# EAGLE schematic TA323v1 (EAGLE 7.2.0)
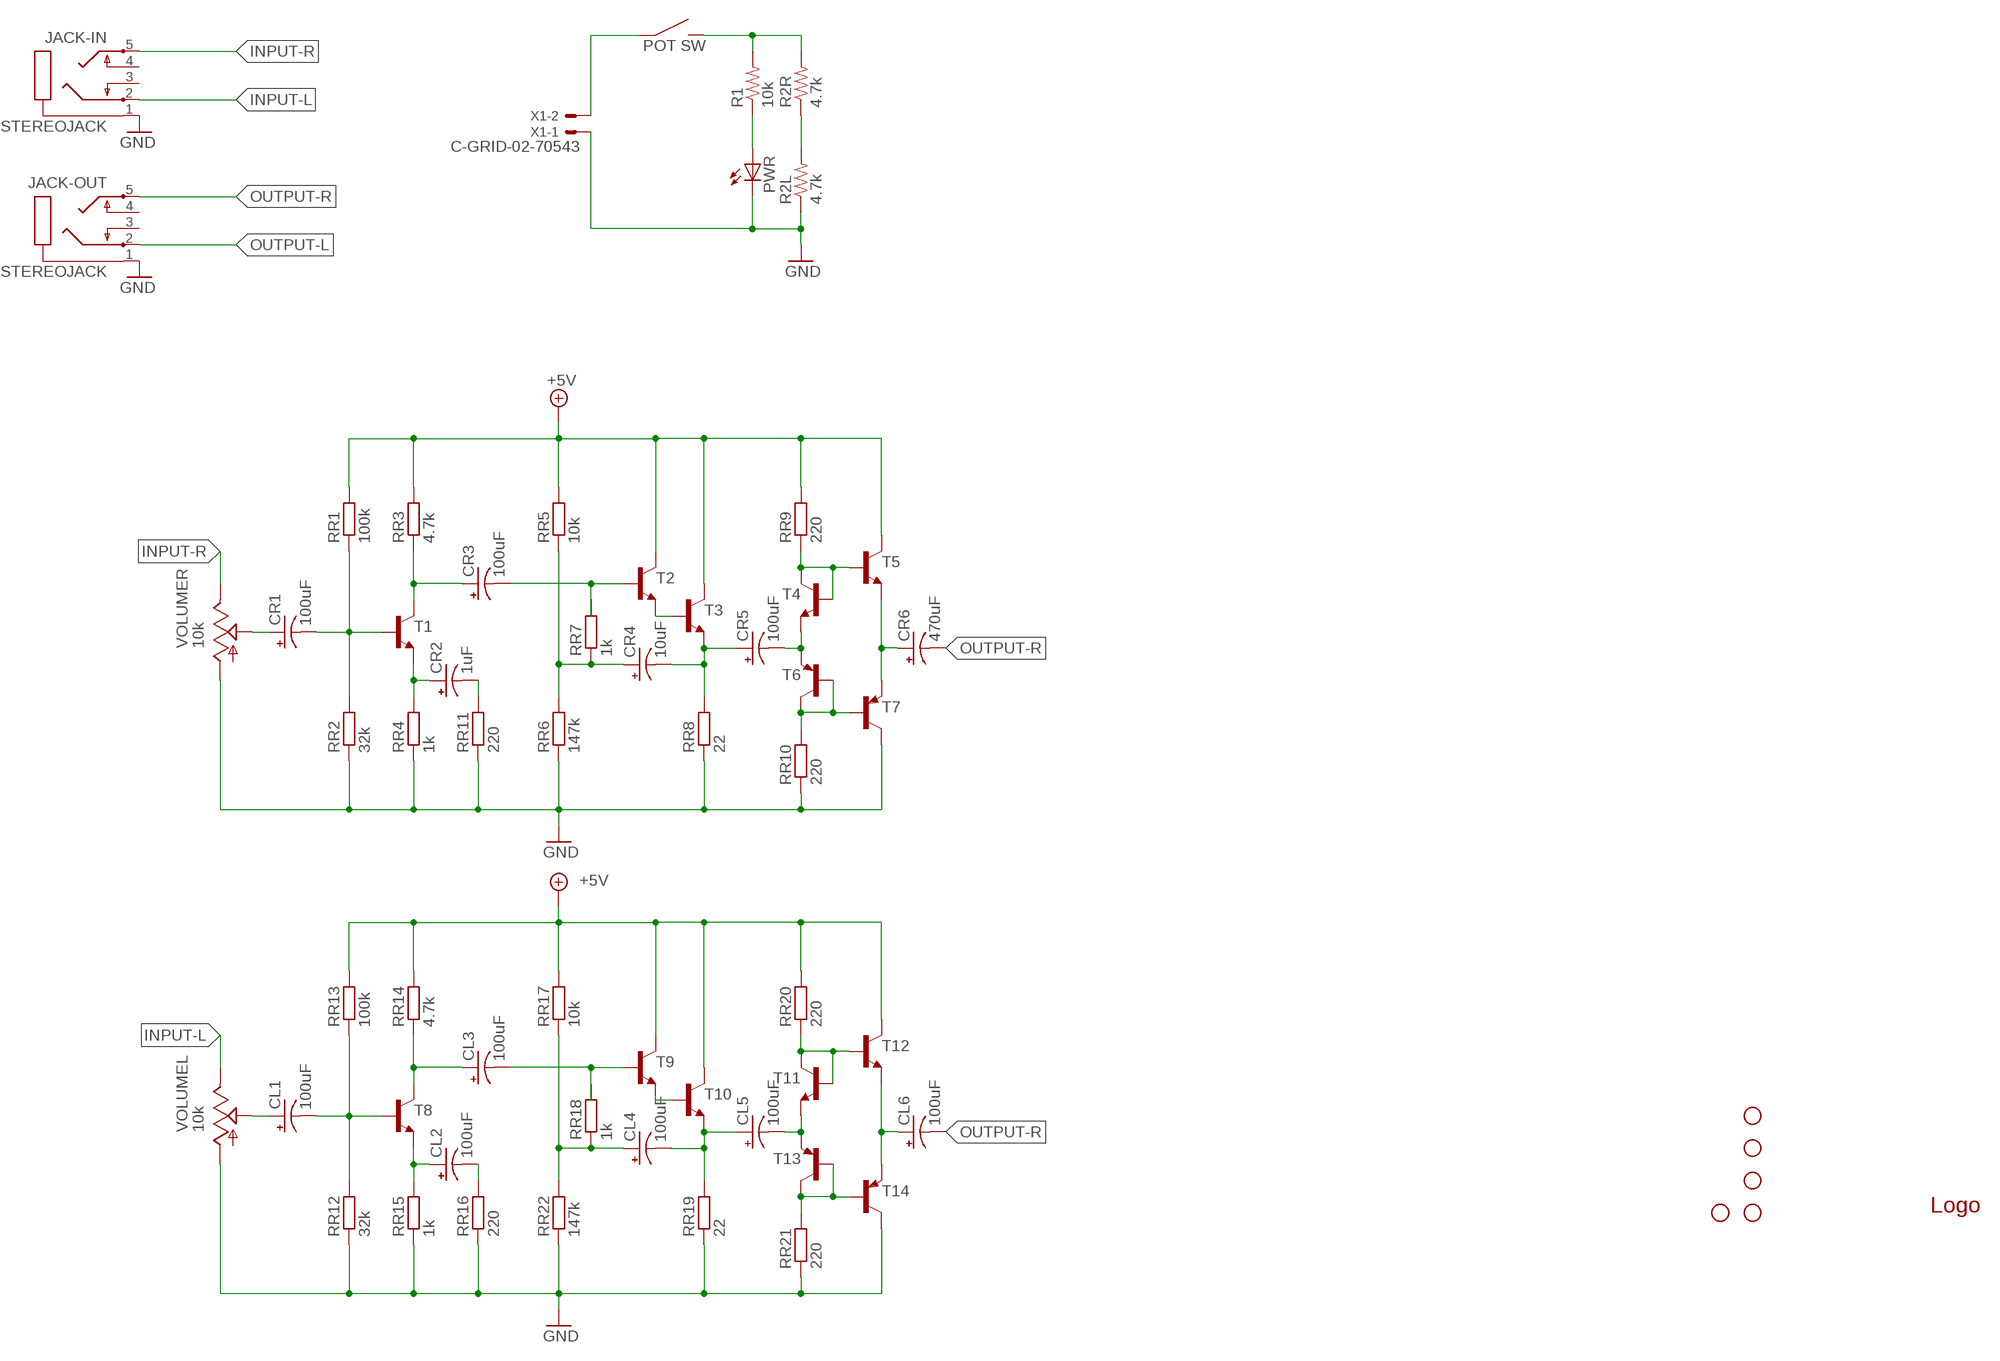
[diagram p0: schematic, sheet 1]

## Parts
CL1  100uF  CPOL-USE5-10.5  [E5-10,5]
CL2  100uF  CPOL-USE5-10.5  [E5-10,5]
CL3  100uF  CPOL-USE5-10.5  [E5-10,5]
CL4  100uF  CPOL-USE5-10.5  [E5-10,5]
CL5  100uF  CPOL-USE5-10.5  [E5-10,5]
CL6  100uF  CPOL-USE5-10.5  [E5-10,5]
CR1  100uF  CPOL-USE5-10.5  [E5-10,5]
CR2  1uF  CPOL-USE5-10.5  [E5-10,5]
CR3  100uF  CPOL-USE5-10.5  [E5-10,5]
CR4  10uF  CPOL-USE5-10.5  [E5-10,5]
CR5  100uF  CPOL-USE5-10.5  [E5-10,5]
CR6  470uF  CPOL-USE5-10.5  [E5-10,5]
JACK-IN  STEREOJACK  [STX3100]
JACK-OUT  STEREOJACK  [STX3100]
JP1  STAND-OFF  [STAND-OFF]
JP2  STAND-OFF  [STAND-OFF]
JP3  STAND-OFF  [STAND-OFF]
JP4  STAND-OFF  [STAND-OFF]
JP5  STAND-OFF  [STAND-OFF]
PWR  LED-3MM-MINUS  [LED3MM-MINUS]
R1  10k  RESISTOR-PTH-1/6W-OUTLINE  [1/6W-RES-OUTLINE]
R2L  4.7k  RESISTOR-PTH-1/6W-OUTLINE  [1/6W-RES-OUTLINE]
R2R  4.7k  RESISTOR-PTH-1/6W-OUTLINE  [1/6W-RES-OUTLINE]
RR1  100k  R-EU_0204/7  [0204/7]
RR2  32k  R-EU_0204/7  [0204/7]
RR3  4.7k  R-EU_0204/7  [0204/7]
RR4  1k  R-EU_0204/7  [0204/7]
RR5  10k  R-EU_0204/7  [0204/7]
RR6  147k  R-EU_0204/7  [0204/7]
RR7  1k  R-EU_0204/7  [0204/7]
RR8  22  R-EU_0204/7  [0204/7]
RR9  220  R-EU_0204/7  [0204/7]
RR10  220  R-EU_0204/7  [0204/7]
RR11  220  R-EU_0204/7  [0204/7]
RR12  32k  R-EU_0204/7  [0204/7]
RR13  100k  R-EU_0204/7  [0204/7]
RR14  4.7k  R-EU_0204/7  [0204/7]
RR15  1k  R-EU_0204/7  [0204/7]
RR16  220  R-EU_0204/7  [0204/7]
RR17  10k  R-EU_0204/7  [0204/7]
RR18  1k  R-EU_0204/7  [0204/7]
RR19  22  R-EU_0204/7  [0204/7]
RR20  220  R-EU_0204/7  [0204/7]
RR21  220  R-EU_0204/7  [0204/7]
RR22  147k  R-EU_0204/7  [0204/7]
T1  2N4401-NPN-TO92-EBC  [TO92-EBC]
T2  2N4401-NPN-TO92-EBC  [TO92-EBC]
T3  2N4401-NPN-TO92-EBC  [TO92-EBC]
T4  2N4401-NPN-TO92-EBC  [TO92-EBC]
T5  2N4401-NPN-TO92-EBC  [TO92-EBC]
T6  2N4403-PNP-TO92-EBC  [TO92-EBC]
T7  2N4403-PNP-TO92-EBC  [TO92-EBC]
T8  2N4401-NPN-TO92-EBC  [TO92-EBC]
T9  2N4401-NPN-TO92-EBC  [TO92-EBC]
T10  2N4401-NPN-TO92-EBC  [TO92-EBC]
T11  2N4401-NPN-TO92-EBC  [TO92-EBC]
T12  2N4401-NPN-TO92-EBC  [TO92-EBC]
T13  2N4403-PNP-TO92-EBC  [TO92-EBC]
T14  2N4403-PNP-TO92-EBC  [TO92-EBC]
U$1  OSHW-LOGO-OUTLINE  [OSHW-LOGO-OUTLINE]
VOLUME  10k  ALPS_RK0971221Z0N  [ALPS_RK0971221Z0X]
X1  C-GRID-02-70543  [70543-02]

## Nets
+5V: RR1.2 RR3.2 RR5.2 RR9.2 RR13.2 RR14.2 RR17.2 RR20.2 T2.C T3.C T5.C T9.C T10.C T12.C
+9V: R1.2 R2R.2 VOLUME.S2
GND: JACK-IN.1 JACK-OUT.1 PWR.K(C) R2L.1 RR2.1 RR4.1 RR6.1 RR8.1 RR10.1 RR11.1 RR12.1 RR15.1 RR16.1 RR19.1 RR21.1 RR22.1 T7.C T14.C VOLUME.G1 VOLUME.G2 X1.1
INPUT-L: JACK-IN.2 VOLUME.I1
INPUT-R: JACK-IN.5 VOLUME.I2
N$1: PWR.A R1.1
N$2: VOLUME.S1 X1.2
N$3: T2.E T3.B
N$4: CR3.+ RR3.1 T1.C
N$5: RR20.1 T11.B T11.C T12.B
N$6: CL5.- T11.E T13.E
N$7: RR21.2 T13.B T13.C T14.B
N$8: CL6.+ T12.E T14.E
N$9: CL4.- CL5.+ RR19.2 T10.E
N$10: CL4.+ RR17.1 RR18.1 RR22.2
N$11: CL3.- T9.B
N$12: CL2.- RR16.2
N$13: CL2.+ RR15.2 T8.E
N$14: CL1.+ VOLUME.O1
N$15: T9.E T10.B
N$16: CL3.+ RR14.1 T8.C
N$18: R2L.2 R2R.1
N$22: RR9.1 T4.B T4.C T5.B
N$23: CR5.- T4.E T6.E
N$24: RR10.2 T6.B T6.C T7.B
N$25: CR6.+ T5.E T7.E
N$26: CR4.- CR5.+ RR8.2 T3.E
N$27: CR4.+ RR5.1 RR6.2 RR7.1
N$28: CR3.- T2.B
N$30: CR2.- RR11.2
N$31: CR2.+ RR4.2 T1.E
N$32: CR1.+ VOLUME.O2
OUTPUT-L: JACK-OUT.2
OUTPUT-R: JACK-OUT.5
R+: CR1.- RR1.1 RR2.2 T1.B
R+1: CL1.- RR12.2 RR13.1 T8.B
Unconnected: CL6.- CR6.- JACK-IN.3 JACK-IN.4 JACK-OUT.3 JACK-OUT.4 RR7.2 RR18.2

## Library data of the parts
CL1-CL6 CR1-CR6 = rcl:CPOL-US: POLARIZED CAPACITOR, American symbol
JACK-IN JACK-OUT = akafugu:STEREOJACK: MIC/HEADPHONE JACK Stereo jack with two switches. Kycon STX3100, CUI SJ1-3555NG and/or 4UCon 05544
JP1-JP5 = SparkFun:STAND-OFF: Stand Off This is the mechanical footprint for a #4 phillips button head screw. Use the keepout ring to avoid running the screw head into surrounding components. SKU : PRT-00447
PWR = akafugu:LED: LEDs Standard schematic elements and footprints for 5mm, 3mm, 1206, and 0603 sized LEDs. 5mm - Spark Fun Electronics SKU : COM-00529 (and others)
R1 R2L R2R = akafugu:RESISTOR: Resistor Basic schematic elements and footprints for 0603, 1206, and PTH resistors.
RR1-RR22 = rcl:R-EU_: RESISTOR, European symbol
T1-T5 T8-T12 = transistor-neu-to92:*-NPN-: NPN Transistror
T6 T7 T13 T14 = transistor-neu-to92:*-PNP-: PNP Transistror
U$1 = akafugu:OSHW-LOGO
VOLUME = audio-pots:ALPS_RK0971221Z0*: ALPS RK0971221Z Dual-gang 9mm potentiometer for volume control, with SPST switch -05 model: 10K with "volume" taper -0N model: 50K with traditional audio taper
X1 = con-molex:C-GRID-02: CONNECTOR wire to board 2.54 mm (0.100") pitch header; OC_FARNELL: unknown; OC_NEWARK: unknown

## Net classes
0 default: width 0.254 mm, drill 0.305 mm, clearance 0.152 mm